# Altium schematic sheet PressureSensors.SchDoc
size A4; SheetNumber: 2; SheetTotal: 5
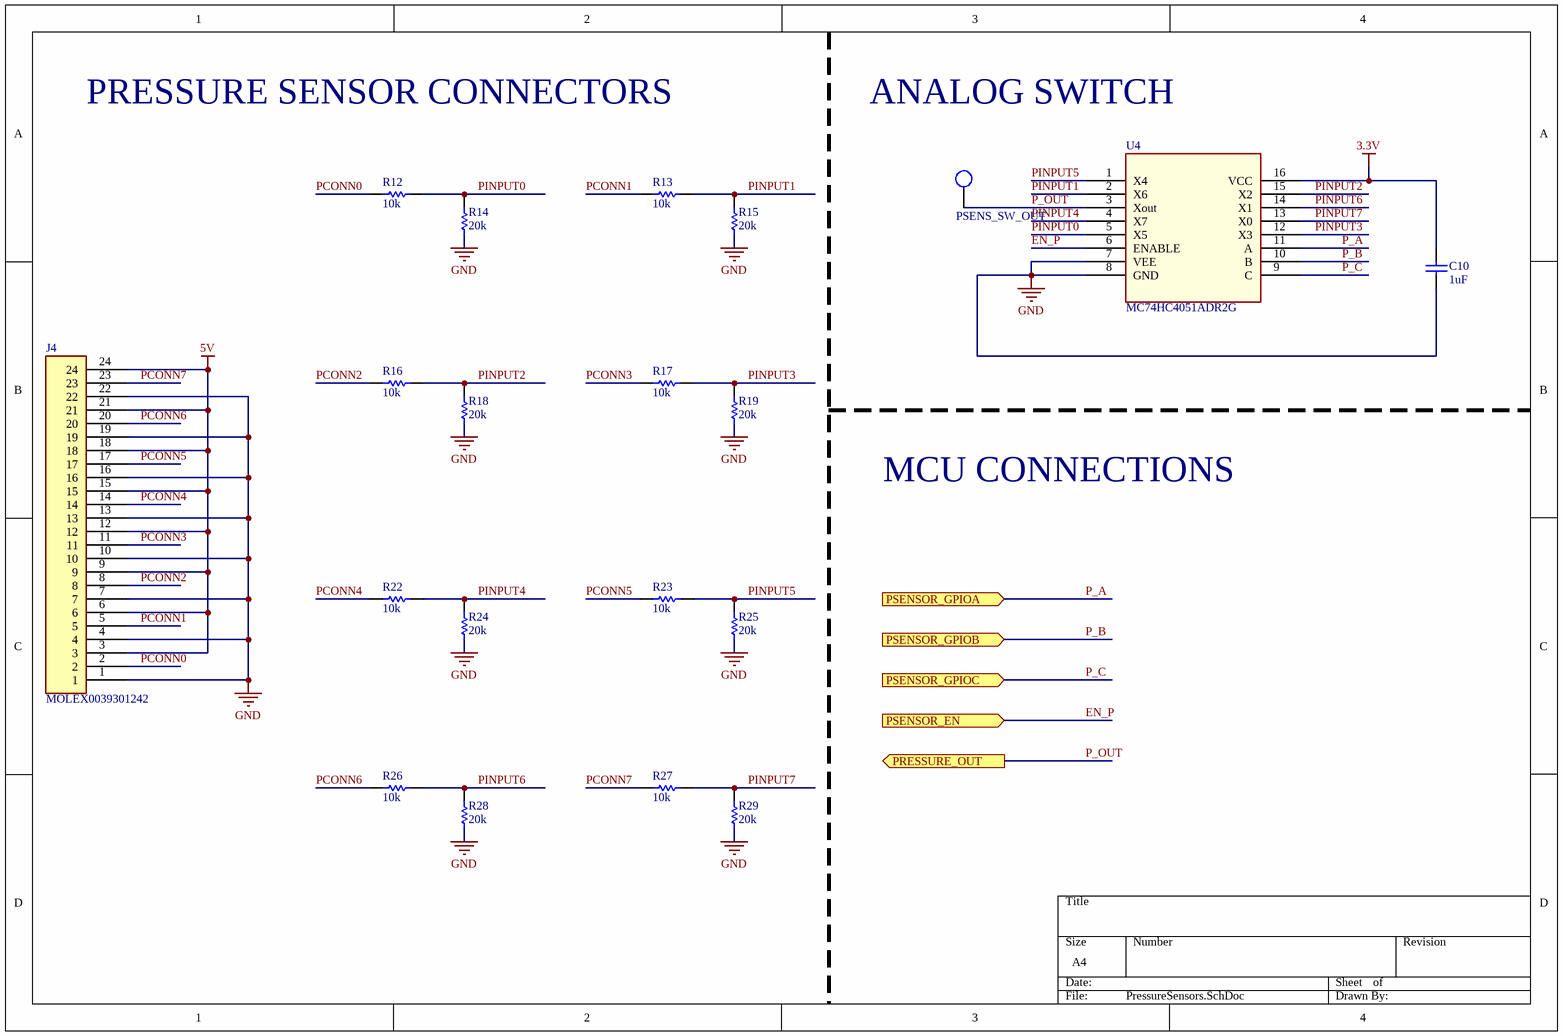
[diagram p0: PressureSensors.SchDoc]

## Parts
C10  value 1uF  [0603 - Capacitor]  (hidden comment: Capacitor - Nonpolarized)
J4  MOLEX0039301242  [MOLEX0039301242]
PSENS_SW_OUT  Test Point  [Test Point - 5002]  (value not drawn)  (no BOM)
R12  value 10k  [0805 - Resistor]  (hidden comment: Resistor)
R13  value 10k  [0805 - Resistor]  (hidden comment: Resistor)
R14  value 20k  [0805 - Resistor]  (hidden comment: Resistor)
R15  value 20k  [0805 - Resistor]  (hidden comment: Resistor)
R16  value 10k  [0805 - Resistor]  (hidden comment: Resistor)
R17  value 10k  [0805 - Resistor]  (hidden comment: Resistor)
R18  value 20k  [0805 - Resistor]  (hidden comment: Resistor)
R19  value 20k  [0805 - Resistor]  (hidden comment: Resistor)
R22  value 10k  [0805 - Resistor]  (hidden comment: Resistor)
R23  value 10k  [0805 - Resistor]  (hidden comment: Resistor)
R24  value 20k  [0805 - Resistor]  (hidden comment: Resistor)
R25  value 20k  [0805 - Resistor]  (hidden comment: Resistor)
R26  value 10k  [0805 - Resistor]  (hidden comment: Resistor)
R27  value 10k  [0805 - Resistor]  (hidden comment: Resistor)
R28  value 20k  [0805 - Resistor]  (hidden comment: Resistor)
R29  value 20k  [0805 - Resistor]  (hidden comment: Resistor)
U4  MC74HC4051ADR2G  [MC74HC4051ADR2G]

## Ports
PRESSURE_OUT (out), PSENSOR_EN (in), PSENSOR_GPIOA (in), PSENSOR_GPIOB (in), PSENSOR_GPIOC (in)

## Nets
3.3V: C10.2 U4.16(VCC)
5V: J4.3 J4.6 J4.9 J4.12 J4.15 J4.18 J4.21 J4.24
GND: C10.1 J4.1 J4.4 J4.7 J4.10 J4.13 J4.16 J4.19 J4.22 R14.1 R15.1 R18.1 R19.1 R24.1 R25.1 R28.1 R29.1 U4.7(VEE) U4.8(GND)
EN_P: U4.6(ENABLE) ; port PSENSOR_EN
P_A: U4.11(A) ; port PSENSOR_GPIOA
P_B: U4.10(B) ; port PSENSOR_GPIOB
P_C: U4.9(C) ; port PSENSOR_GPIOC
P_OUT: PSENS_SW_OUT.1 U4.3(Xout) ; port PRESSURE_OUT
PCONN0: J4.2 R12.1
PCONN1: J4.5 R13.1
PCONN2: J4.8 R16.1
PCONN3: J4.11 R17.1
PCONN4: J4.14 R22.1
PCONN5: J4.17 R23.1
PCONN6: J4.20 R26.1
PCONN7: J4.23 R27.1
PINPUT0: R12.2 R14.2 U4.5(X5)
PINPUT1: R13.2 R15.2 U4.2(X6)
PINPUT2: R16.2 R18.2 U4.15(X2)
PINPUT3: R17.2 R19.2 U4.12(X3)
PINPUT4: R22.2 R24.2 U4.4(X7)
PINPUT5: R23.2 R25.2 U4.1(X4)
PINPUT6: R26.2 R28.2 U4.14(X1)
PINPUT7: R27.2 R29.2 U4.13(X0)

## Notes on the sheet
- PRESSURE SENSOR CONNECTORS
- ANALOG SWITCH
- MCU CONNECTIONS

## Library data of the parts
C10 = Capacitor - Nonpolarized: Nonpolarized Capacitor; Supplier Part Number: *; Supplier: *; Manufacturer: *; Rating: *; Manufacturer Part Number: *
J4 = MOLEX0039301242: Connector Header Through Hole, Right Angle 24 position 0.165" (4.20mm); Manufacturer: Molex; Manufacturer Part Number: 0039301082; Supplier: DigiKey; Supplier Part Number: WM21366-ND; ComponentLink1Description: Datasheet; ComponentLink1URL: https://www.molex.com/pdm_docs/sd/039301082_sd.pdf
U4 = MC74HC4051ADR2G: 1 Circuit IC Switch 8:1 100Ohm 16-SOIC; Manufacturer Name: onsemi; Manufacturer Part Number: MC74HC4051ADR2G; Supplier Name: Digikey; Supplier Part Number: MC74HC4051ADR2GOSTR-ND
R12-R19 R22-R29 = Resistor: Rating: *; Manufacturer Part Number: *; Manufacturer: *; Supplier Part Number: *; Supplier: *